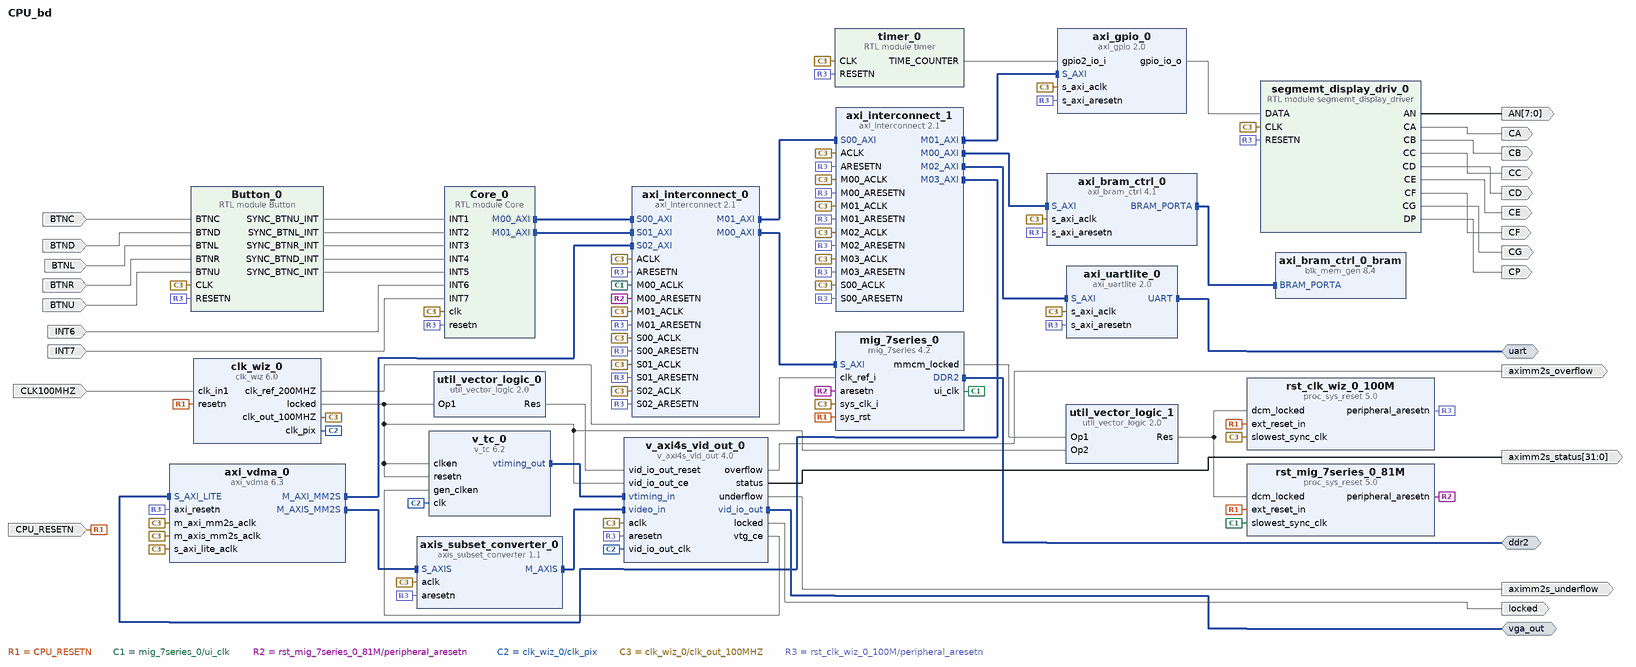
[diagram p0: block diagram of the top level]
# Vivado block design CPU_bd, xc7a100tcsg324-1, Vivado 2020.1_AR75502_AR75502
create_bd_design CPU_bd

create_bd_intf_port -mode Master -vlnv xilinx.com:interface:uart_rtl:1.0 uart
create_bd_intf_port -mode Master -vlnv xilinx.com:interface:ddrx_rtl:1.0 ddr2
create_bd_intf_port -mode Master -vlnv xilinx.com:interface:vid_io_rtl:1.0 vga_out
create_bd_port -dir I -type clk CLK100MHZ
set_property -dict {CONFIG.FREQ_HZ 100000000} [get_bd_ports CLK100MHZ]
create_bd_port -dir I -type rst CPU_RESETN
create_bd_port -dir O -from 7 -to 0 -type data AN
create_bd_port -dir O -type data CA
create_bd_port -dir O -type data CB
create_bd_port -dir O -type data CC
create_bd_port -dir O -type data CD
create_bd_port -dir O -type data CE
create_bd_port -dir O -type data CF
create_bd_port -dir O -type data CG
create_bd_port -dir O -type data CP
create_bd_port -dir I INT6
create_bd_port -dir I INT7
create_bd_port -dir O aximm2s_overflow
create_bd_port -dir O aximm2s_underflow
create_bd_port -dir O -from 31 -to 0 aximm2s_status
create_bd_port -dir O locked
create_bd_port -dir I BTNC
create_bd_port -dir I BTND
create_bd_port -dir I BTNL
create_bd_port -dir I BTNR
create_bd_port -dir I BTNU

create_bd_cell -type ip -vlnv xilinx.com:ip:axi_gpio:2.0 axi_gpio_0
set_property -dict {CONFIG.C_ALL_INPUTS_2 1 CONFIG.C_ALL_OUTPUTS 1 CONFIG.C_IS_DUAL 1} [get_bd_cells axi_gpio_0]
create_bd_cell -type ip -vlnv xilinx.com:ip:axi_bram_ctrl:4.1 axi_bram_ctrl_0
set_property -dict {CONFIG.SINGLE_PORT_BRAM 1} [get_bd_cells axi_bram_ctrl_0]
create_bd_cell -type module -reference segmemt_display_driver segmemt_display_driv_0
create_bd_cell -type ip -vlnv xilinx.com:ip:axi_uartlite:2.0 axi_uartlite_0
create_bd_cell -type ip -vlnv xilinx.com:ip:clk_wiz:6.0 clk_wiz_0
set_property -dict [list \
  CONFIG.CLKOUT1_JITTER 137.143 \
  CONFIG.CLKOUT1_REQUESTED_OUT_FREQ 80.000 \
  CONFIG.CLKOUT2_JITTER 114.829 \
  CONFIG.CLKOUT2_PHASE_ERROR 98.575 \
  CONFIG.CLKOUT2_REQUESTED_OUT_FREQ 200.000 \
  CONFIG.CLKOUT2_USED true \
  CONFIG.CLKOUT3_JITTER 159.371 \
  CONFIG.CLKOUT3_PHASE_ERROR 98.575 \
  CONFIG.CLKOUT3_REQUESTED_OUT_FREQ 40 \
  CONFIG.CLKOUT3_USED true \
  CONFIG.CLK_OUT1_PORT clk_out_100MHZ \
  CONFIG.CLK_OUT2_PORT clk_ref_200MHZ \
  CONFIG.CLK_OUT3_PORT clk_pix \
  CONFIG.MMCM_CLKOUT0_DIVIDE_F 12.500 \
  CONFIG.MMCM_CLKOUT1_DIVIDE 5 \
  CONFIG.MMCM_CLKOUT2_DIVIDE 25 \
  CONFIG.NUM_OUT_CLKS 3 \
  CONFIG.RESET_PORT resetn \
  CONFIG.RESET_TYPE ACTIVE_LOW \
] [get_bd_cells clk_wiz_0]
create_bd_cell -type ip -vlnv xilinx.com:ip:proc_sys_reset:5.0 rst_clk_wiz_0_100M
set_property -dict {CONFIG.C_NUM_PERP_ARESETN 1 CONFIG.C_NUM_PERP_RST 1} [get_bd_cells rst_clk_wiz_0_100M]
create_bd_cell -type ip -vlnv xilinx.com:ip:blk_mem_gen:8.4 axi_bram_ctrl_0_bram
set_property -dict [list \
  CONFIG.Coe_File ../../../../../boot_loader/bootloader.coe \
  CONFIG.Load_Init_File true \
  CONFIG.Memory_Type Single_Port_ROM \
  CONFIG.Port_A_Write_Rate 0 \
] [get_bd_cells axi_bram_ctrl_0_bram]
create_bd_cell -type ip -vlnv xilinx.com:ip:axi_interconnect:2.1 axi_interconnect_0
set_property -dict [list \
  CONFIG.ENABLE_ADVANCED_OPTIONS 1 \
  CONFIG.NUM_MI 2 \
  CONFIG.NUM_SI 3 \
  CONFIG.S00_ARB_PRIORITY 0 \
] [get_bd_cells axi_interconnect_0]
create_bd_cell -type ip -vlnv xilinx.com:ip:mig_7series:4.2 mig_7series_0
set_property -dict [list \
  CONFIG.BOARD_MIG_PARAM Custom \
  CONFIG.MIG_DONT_TOUCH_PARAM Custom \
  CONFIG.RESET_BOARD_INTERFACE Custom \
  CONFIG.XML_INPUT_FILE mig_b.prj \
] [get_bd_cells mig_7series_0]
create_bd_cell -type ip -vlnv xilinx.com:ip:proc_sys_reset:5.0 rst_mig_7series_0_81M
create_bd_cell -type ip -vlnv xilinx.com:ip:v_axi4s_vid_out:4.0 v_axi4s_vid_out_0
set_property -dict [list \
  CONFIG.C_ADDR_WIDTH 10 \
  CONFIG.C_HAS_ASYNC_CLK 1 \
  CONFIG.C_S_AXIS_VIDEO_FORMAT 2 \
  CONFIG.C_VTG_MASTER_SLAVE 0 \
] [get_bd_cells v_axi4s_vid_out_0]
create_bd_cell -type ip -vlnv xilinx.com:ip:v_tc:6.2 v_tc_0
set_property -dict [list \
  CONFIG.GEN_F0_VBLANK_HEND 600 \
  CONFIG.GEN_F0_VBLANK_HSTART 600 \
  CONFIG.GEN_F0_VFRAME_SIZE 628 \
  CONFIG.GEN_F0_VSYNC_HEND 600 \
  CONFIG.GEN_F0_VSYNC_HSTART 600 \
  CONFIG.GEN_F0_VSYNC_VEND 604 \
  CONFIG.GEN_F0_VSYNC_VSTART 600 \
  CONFIG.GEN_HACTIVE_SIZE 800 \
  CONFIG.GEN_HFRAME_SIZE 1056 \
  CONFIG.GEN_HSYNC_END 968 \
  CONFIG.GEN_HSYNC_START 840 \
  CONFIG.GEN_VACTIVE_SIZE 600 \
  CONFIG.HAS_AXI4_LITE false \
  CONFIG.INTERLACE_EN false \
  CONFIG.VIDEO_MODE Custom \
  CONFIG.active_video_generation true \
  CONFIG.enable_detection false \
  CONFIG.enable_generation true \
  CONFIG.horizontal_blank_generation true \
  CONFIG.vertical_blank_generation true \
] [get_bd_cells v_tc_0]
create_bd_cell -type ip -vlnv xilinx.com:ip:util_vector_logic:2.0 util_vector_logic_0
set_property -dict {CONFIG.C_OPERATION not CONFIG.C_SIZE 1} [get_bd_cells util_vector_logic_0]
create_bd_cell -type ip -vlnv xilinx.com:ip:axi_vdma:6.3 axi_vdma_0
set_property -dict [list \
  CONFIG.c_include_s2mm 0 \
  CONFIG.c_m_axis_mm2s_tdata_width 16 \
  CONFIG.c_mm2s_genlock_mode 0 \
  CONFIG.c_mm2s_linebuffer_depth 512 \
  CONFIG.c_num_fstores 1 \
  CONFIG.c_use_mm2s_fsync 0 \
] [get_bd_cells axi_vdma_0]
create_bd_cell -type ip -vlnv xilinx.com:ip:axis_subset_converter:1.1 axis_subset_converter_0
set_property -dict [list \
  CONFIG.M_TDATA_NUM_BYTES 3 \
  CONFIG.S_TDATA_NUM_BYTES 2 \
  CONFIG.TDATA_REMAP {8'b00000000,tdata[15:0]} \
  CONFIG.TKEEP_REMAP {1'b1,tkeep[1:0]} \
] [get_bd_cells axis_subset_converter_0]
create_bd_cell -type module -reference Button Button_0
create_bd_cell -type ip -vlnv xilinx.com:ip:util_vector_logic:2.0 util_vector_logic_1
set_property -dict {CONFIG.C_OPERATION and CONFIG.C_SIZE 1} [get_bd_cells util_vector_logic_1]
create_bd_cell -type ip -vlnv xilinx.com:ip:axi_interconnect:2.1 axi_interconnect_1
set_property -dict {CONFIG.ENABLE_ADVANCED_OPTIONS 0 CONFIG.NUM_MI 4} [get_bd_cells axi_interconnect_1]
create_bd_cell -type module -reference timer timer_0
create_bd_cell -type module -reference Core Core_0

# ---- connections ----

connect_bd_intf_net [get_bd_intf_ports vga_out] [get_bd_intf_pins v_axi4s_vid_out_0/vid_io_out]
connect_bd_intf_net [get_bd_intf_pins axi_interconnect_0/S00_AXI] [get_bd_intf_pins Core_0/M00_AXI]
connect_bd_intf_net [get_bd_intf_pins axi_interconnect_1/M00_AXI] [get_bd_intf_pins axi_bram_ctrl_0/S_AXI]
connect_bd_intf_net [get_bd_intf_pins axis_subset_converter_0/S_AXIS] [get_bd_intf_pins axi_vdma_0/M_AXIS_MM2S]
connect_bd_intf_net [get_bd_intf_pins axis_subset_converter_0/M_AXIS] [get_bd_intf_pins v_axi4s_vid_out_0/video_in]
connect_bd_intf_net [get_bd_intf_pins axi_interconnect_0/M01_AXI] [get_bd_intf_pins axi_interconnect_1/S00_AXI]
connect_bd_intf_net [get_bd_intf_pins axi_bram_ctrl_0_bram/BRAM_PORTA] [get_bd_intf_pins axi_bram_ctrl_0/BRAM_PORTA]
connect_bd_intf_net [get_bd_intf_pins axi_interconnect_0/M00_AXI] [get_bd_intf_pins mig_7series_0/S_AXI]
connect_bd_intf_net [get_bd_intf_pins axi_interconnect_1/M03_AXI] [get_bd_intf_pins axi_vdma_0/S_AXI_LITE]
connect_bd_intf_net [get_bd_intf_pins axi_interconnect_0/S01_AXI] [get_bd_intf_pins Core_0/M01_AXI]
connect_bd_intf_net [get_bd_intf_ports ddr2] [get_bd_intf_pins mig_7series_0/DDR2]
connect_bd_intf_net [get_bd_intf_pins axi_interconnect_1/M02_AXI] [get_bd_intf_pins axi_uartlite_0/S_AXI]
connect_bd_intf_net [get_bd_intf_pins axi_interconnect_1/M01_AXI] [get_bd_intf_pins axi_gpio_0/S_AXI]
connect_bd_intf_net [get_bd_intf_pins axi_vdma_0/M_AXI_MM2S] [get_bd_intf_pins axi_interconnect_0/S02_AXI]
connect_bd_intf_net [get_bd_intf_ports uart] [get_bd_intf_pins axi_uartlite_0/UART]
connect_bd_intf_net [get_bd_intf_pins v_tc_0/vtiming_out] [get_bd_intf_pins v_axi4s_vid_out_0/vtiming_in]
connect_bd_net [get_bd_pins segmemt_display_driv_0/AN] [get_bd_ports AN]
connect_bd_net [get_bd_pins segmemt_display_driv_0/CA] [get_bd_ports CA]
connect_bd_net [get_bd_pins segmemt_display_driv_0/CB] [get_bd_ports CB]
connect_bd_net [get_bd_pins segmemt_display_driv_0/CC] [get_bd_ports CC]
connect_bd_net [get_bd_pins segmemt_display_driv_0/CD] [get_bd_ports CD]
connect_bd_net [get_bd_pins segmemt_display_driv_0/CE] [get_bd_ports CE]
connect_bd_net [get_bd_pins segmemt_display_driv_0/CF] [get_bd_ports CF]
connect_bd_net [get_bd_pins segmemt_display_driv_0/CG] [get_bd_ports CG]
connect_bd_net [get_bd_pins segmemt_display_driv_0/DP] [get_bd_ports CP]
connect_bd_net [get_bd_ports CPU_RESETN] \
  [get_bd_pins clk_wiz_0/resetn] [get_bd_pins rst_clk_wiz_0_100M/ext_reset_in] [get_bd_pins mig_7series_0/sys_rst] \
  [get_bd_pins rst_mig_7series_0_81M/ext_reset_in]
connect_bd_net [get_bd_ports CLK100MHZ] [get_bd_pins clk_wiz_0/clk_in1]
connect_bd_net [get_bd_pins clk_wiz_0/locked] \
  [get_bd_pins v_tc_0/clken] [get_bd_pins v_tc_0/resetn] [get_bd_pins v_axi4s_vid_out_0/vid_io_out_ce] \
  [get_bd_pins util_vector_logic_0/Op1] [get_bd_pins util_vector_logic_1/Op2]
connect_bd_net [get_bd_pins clk_wiz_0/clk_ref_200MHZ] [get_bd_pins mig_7series_0/clk_ref_i]
connect_bd_net [get_bd_pins mig_7series_0/ui_clk] [get_bd_pins rst_mig_7series_0_81M/slowest_sync_clk] [get_bd_pins axi_interconnect_0/M00_ACLK]
connect_bd_net [get_bd_pins mig_7series_0/mmcm_locked] [get_bd_pins util_vector_logic_1/Op1]
connect_bd_net [get_bd_pins rst_mig_7series_0_81M/peripheral_aresetn] [get_bd_pins mig_7series_0/aresetn] [get_bd_pins axi_interconnect_0/M00_ARESETN]
connect_bd_net [get_bd_pins v_axi4s_vid_out_0/overflow] [get_bd_ports aximm2s_overflow]
connect_bd_net [get_bd_pins v_axi4s_vid_out_0/underflow] [get_bd_ports aximm2s_underflow]
connect_bd_net [get_bd_pins v_axi4s_vid_out_0/status] [get_bd_ports aximm2s_status]
connect_bd_net [get_bd_pins clk_wiz_0/clk_pix] [get_bd_pins v_tc_0/clk] [get_bd_pins v_axi4s_vid_out_0/vid_io_out_clk]
connect_bd_net [get_bd_pins v_axi4s_vid_out_0/locked] [get_bd_ports locked]
connect_bd_net [get_bd_pins v_axi4s_vid_out_0/vtg_ce] [get_bd_pins v_tc_0/gen_clken]
connect_bd_net [get_bd_pins util_vector_logic_0/Res] [get_bd_pins v_axi4s_vid_out_0/vid_io_out_reset]
connect_bd_net [get_bd_pins axi_gpio_0/gpio_io_o] [get_bd_pins segmemt_display_driv_0/DATA]
connect_bd_net [get_bd_pins Button_0/SYNC_BTNU_INT] [get_bd_pins Core_0/INT1]
connect_bd_net [get_bd_pins Button_0/SYNC_BTNL_INT] [get_bd_pins Core_0/INT2]
connect_bd_net [get_bd_pins Button_0/SYNC_BTNR_INT] [get_bd_pins Core_0/INT3]
connect_bd_net [get_bd_pins Button_0/SYNC_BTND_INT] [get_bd_pins Core_0/INT4]
connect_bd_net [get_bd_pins Button_0/SYNC_BTNC_INT] [get_bd_pins Core_0/INT5]
connect_bd_net -net BTNC_0_1 [get_bd_ports BTNC] [get_bd_pins Button_0/BTNC]
connect_bd_net -net BTND_0_1 [get_bd_ports BTND] [get_bd_pins Button_0/BTND]
connect_bd_net -net BTNL_0_1 [get_bd_ports BTNL] [get_bd_pins Button_0/BTNL]
connect_bd_net -net BTNR_0_1 [get_bd_ports BTNR] [get_bd_pins Button_0/BTNR]
connect_bd_net -net BTNU_0_1 [get_bd_ports BTNU] [get_bd_pins Button_0/BTNU]
connect_bd_net -net INT6_1 [get_bd_ports INT6] [get_bd_pins Core_0/INT6]
connect_bd_net -net INT7_1 [get_bd_ports INT7] [get_bd_pins Core_0/INT7]
connect_bd_net [get_bd_pins util_vector_logic_1/Res] [get_bd_pins rst_mig_7series_0_81M/dcm_locked] [get_bd_pins rst_clk_wiz_0_100M/dcm_locked]
connect_bd_net -net timer_0_TIME [get_bd_pins timer_0/TIME_COUNTER] [get_bd_pins axi_gpio_0/gpio2_io_i]
connect_bd_net -net mig_7series_0_ui_addn_clk_0 [get_bd_pins clk_wiz_0/clk_out_100MHZ] \
  [get_bd_pins axi_bram_ctrl_0/s_axi_aclk] [get_bd_pins axi_gpio_0/s_axi_aclk] [get_bd_pins axi_uartlite_0/s_axi_aclk] \
  [get_bd_pins segmemt_display_driv_0/CLK] [get_bd_pins rst_clk_wiz_0_100M/slowest_sync_clk] \
  [get_bd_pins axi_interconnect_0/ACLK] [get_bd_pins axi_interconnect_0/S00_ACLK] [get_bd_pins axi_interconnect_0/S01_ACLK] \
  [get_bd_pins mig_7series_0/sys_clk_i] [get_bd_pins v_axi4s_vid_out_0/aclk] [get_bd_pins axi_interconnect_0/S02_ACLK] \
  [get_bd_pins axi_vdma_0/s_axi_lite_aclk] [get_bd_pins axi_vdma_0/m_axi_mm2s_aclk] [get_bd_pins axi_vdma_0/m_axis_mm2s_aclk] \
  [get_bd_pins axis_subset_converter_0/aclk] [get_bd_pins Button_0/CLK] [get_bd_pins axi_interconnect_1/ACLK] \
  [get_bd_pins axi_interconnect_1/M00_ACLK] [get_bd_pins axi_interconnect_1/M01_ACLK] \
  [get_bd_pins axi_interconnect_1/M02_ACLK] [get_bd_pins axi_interconnect_1/M03_ACLK] \
  [get_bd_pins axi_interconnect_1/S00_ACLK] [get_bd_pins axi_interconnect_0/M01_ACLK] [get_bd_pins timer_0/CLK] \
  [get_bd_pins Core_0/clk]
connect_bd_net [get_bd_pins rst_clk_wiz_0_100M/peripheral_aresetn] \
  [get_bd_pins axi_bram_ctrl_0/s_axi_aresetn] [get_bd_pins axi_uartlite_0/s_axi_aresetn] \
  [get_bd_pins axi_gpio_0/s_axi_aresetn] [get_bd_pins segmemt_display_driv_0/RESETN] [get_bd_pins axi_interconnect_0/ARESETN] \
  [get_bd_pins axi_interconnect_0/S00_ARESETN] [get_bd_pins axi_interconnect_0/S01_ARESETN] \
  [get_bd_pins v_axi4s_vid_out_0/aresetn] [get_bd_pins axi_interconnect_0/S02_ARESETN] [get_bd_pins axi_vdma_0/axi_resetn] \
  [get_bd_pins axis_subset_converter_0/aresetn] [get_bd_pins Button_0/RESETN] [get_bd_pins axi_interconnect_1/ARESETN] \
  [get_bd_pins axi_interconnect_1/M00_ARESETN] [get_bd_pins axi_interconnect_1/M01_ARESETN] \
  [get_bd_pins axi_interconnect_1/M02_ARESETN] [get_bd_pins axi_interconnect_1/M03_ARESETN] \
  [get_bd_pins axi_interconnect_1/S00_ARESETN] [get_bd_pins axi_interconnect_0/M01_ARESETN] [get_bd_pins timer_0/RESETN] \
  [get_bd_pins Core_0/resetn]

# ---- address map ----
assign_bd_address -offset 0xC8000000 -range 128M -target_address_space [get_bd_addr_spaces axi_vdma_0/Data_MM2S] [get_bd_addr_segs mig_7series_0/memmap/memaddr]
exclude_bd_addr_seg -offset 0x00000000 -range 1 -target_address_space [get_bd_addr_spaces axi_vdma_0/Data_MM2S] [get_bd_addr_segs axi_gpio_0/S_AXI/Reg]
exclude_bd_addr_seg -offset 0x00000000 -range 1 -target_address_space [get_bd_addr_spaces axi_vdma_0/Data_MM2S] [get_bd_addr_segs axi_uartlite_0/S_AXI/Reg]
exclude_bd_addr_seg -offset 0x00000000 -range 1 -target_address_space [get_bd_addr_spaces axi_vdma_0/Data_MM2S] [get_bd_addr_segs axi_vdma_0/S_AXI_LITE/Reg]
exclude_bd_addr_seg -offset 0x40000000 -range 64K -target_address_space [get_bd_addr_spaces axi_vdma_0/Data_MM2S] [get_bd_addr_segs axi_gpio_0/S_AXI/Reg]
exclude_bd_addr_seg -offset 0x40600000 -range 64K -target_address_space [get_bd_addr_spaces axi_vdma_0/Data_MM2S] [get_bd_addr_segs axi_uartlite_0/S_AXI/Reg]
exclude_bd_addr_seg -offset 0x44A00000 -range 64K -target_address_space [get_bd_addr_spaces axi_vdma_0/Data_MM2S] [get_bd_addr_segs axi_vdma_0/S_AXI_LITE/Reg]
exclude_bd_addr_seg -offset 0xC0000000 -range 8K -target_address_space [get_bd_addr_spaces axi_vdma_0/Data_MM2S] [get_bd_addr_segs axi_bram_ctrl_0/S_AXI/Mem0]
assign_bd_address -offset 0xC0000000 -range 8K -target_address_space [get_bd_addr_spaces Core_0/M00_AXI] [get_bd_addr_segs axi_bram_ctrl_0/S_AXI/Mem0]
assign_bd_address -offset 0xC8000000 -range 128M -target_address_space [get_bd_addr_spaces Core_0/M00_AXI] [get_bd_addr_segs mig_7series_0/memmap/memaddr]
exclude_bd_addr_seg -offset 0x40000000 -range 64K -target_address_space [get_bd_addr_spaces Core_0/M00_AXI] [get_bd_addr_segs axi_gpio_0/S_AXI/Reg]
exclude_bd_addr_seg -offset 0x40600000 -range 64K -target_address_space [get_bd_addr_spaces Core_0/M00_AXI] [get_bd_addr_segs axi_uartlite_0/S_AXI/Reg]
exclude_bd_addr_seg -offset 0x44A00000 -range 64K -target_address_space [get_bd_addr_spaces Core_0/M00_AXI] [get_bd_addr_segs axi_vdma_0/S_AXI_LITE/Reg]
assign_bd_address -offset 0x40000000 -range 64K -target_address_space [get_bd_addr_spaces Core_0/M01_AXI] [get_bd_addr_segs axi_gpio_0/S_AXI/Reg]
assign_bd_address -offset 0x40600000 -range 64K -target_address_space [get_bd_addr_spaces Core_0/M01_AXI] [get_bd_addr_segs axi_uartlite_0/S_AXI/Reg]
assign_bd_address -offset 0x44A00000 -range 64K -target_address_space [get_bd_addr_spaces Core_0/M01_AXI] [get_bd_addr_segs axi_vdma_0/S_AXI_LITE/Reg]
assign_bd_address -offset 0xC0000000 -range 8K -target_address_space [get_bd_addr_spaces Core_0/M01_AXI] [get_bd_addr_segs axi_bram_ctrl_0/S_AXI/Mem0]
assign_bd_address -offset 0xC8000000 -range 128M -target_address_space [get_bd_addr_spaces Core_0/M01_AXI] [get_bd_addr_segs mig_7series_0/memmap/memaddr]

validate_bd_design
save_bd_design
